# Altium schematic sheet 2012_FDP_SCHEMA.SchDoc
size A1
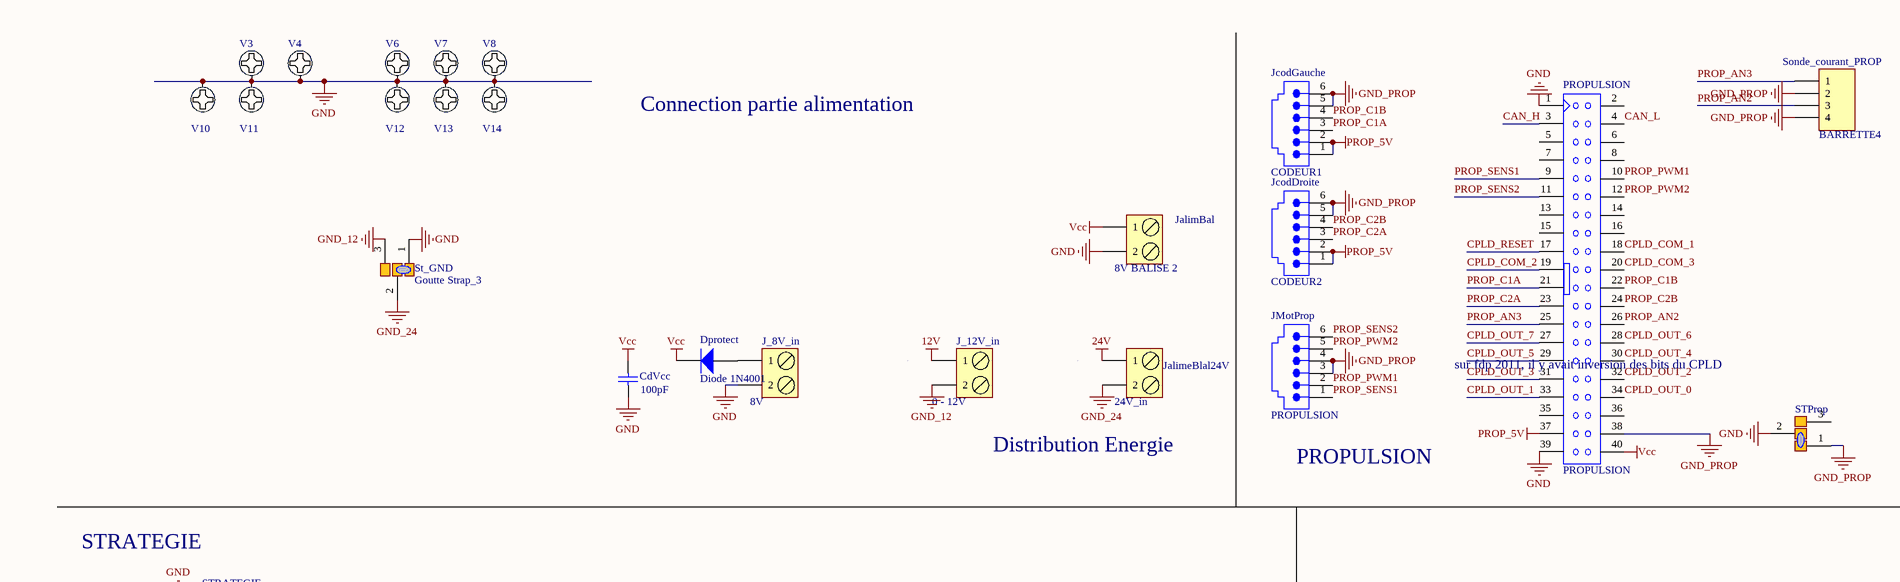
[diagram p0: 2012_FDP_SCHEMA.SchDoc, top left]
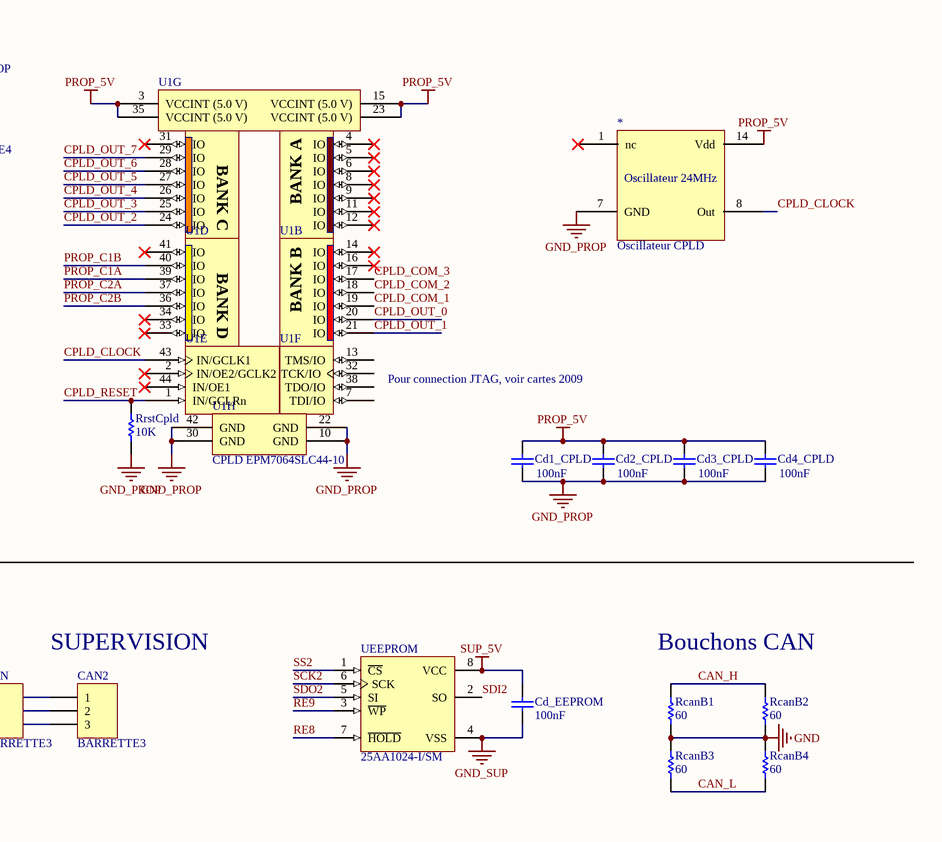
[diagram p1: 2012_FDP_SCHEMA.SchDoc, top right]
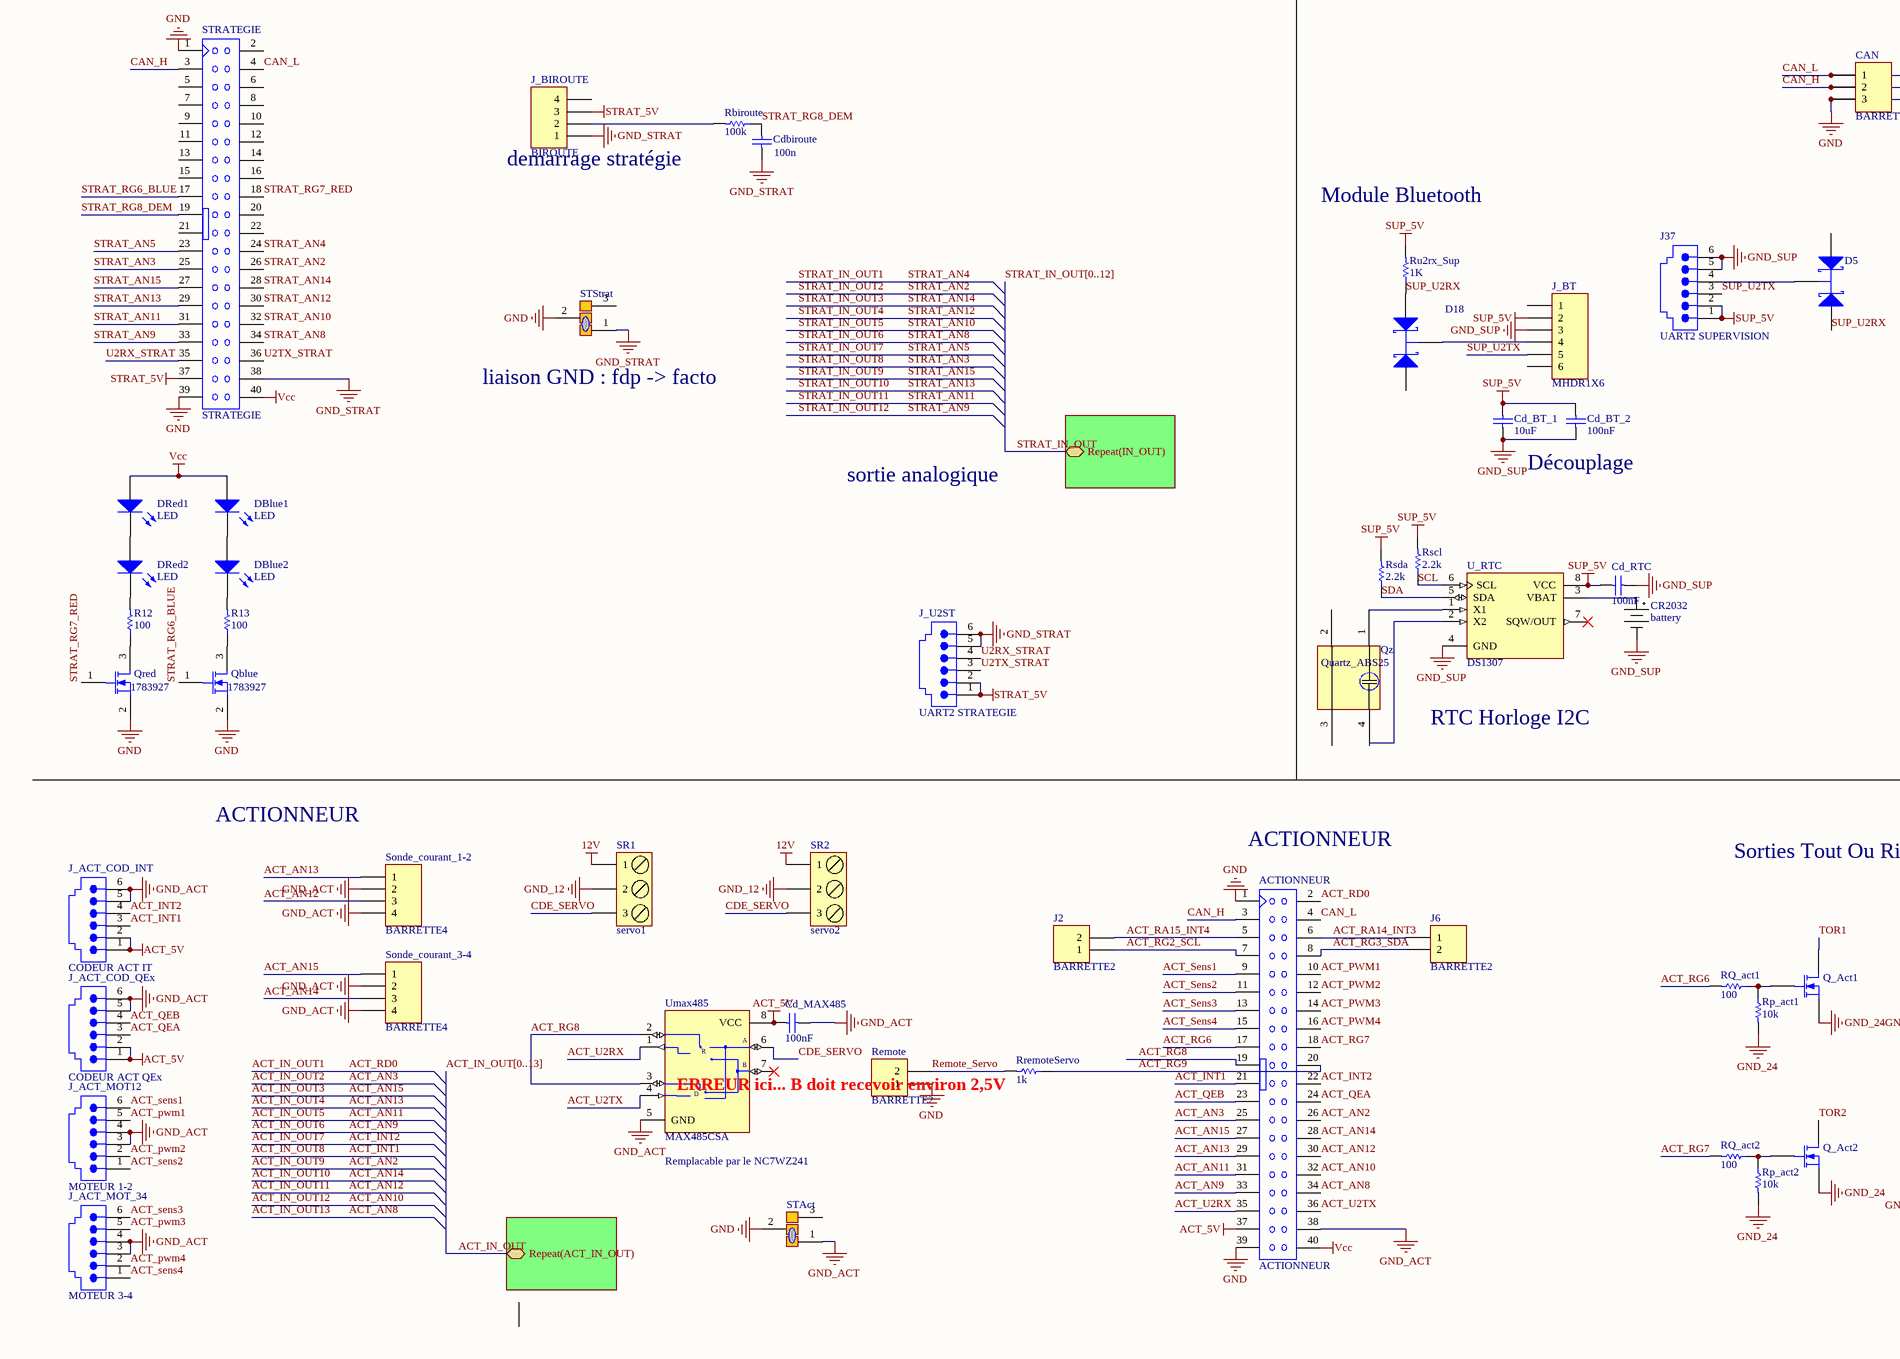
[diagram p2: 2012_FDP_SCHEMA.SchDoc, bottom left]
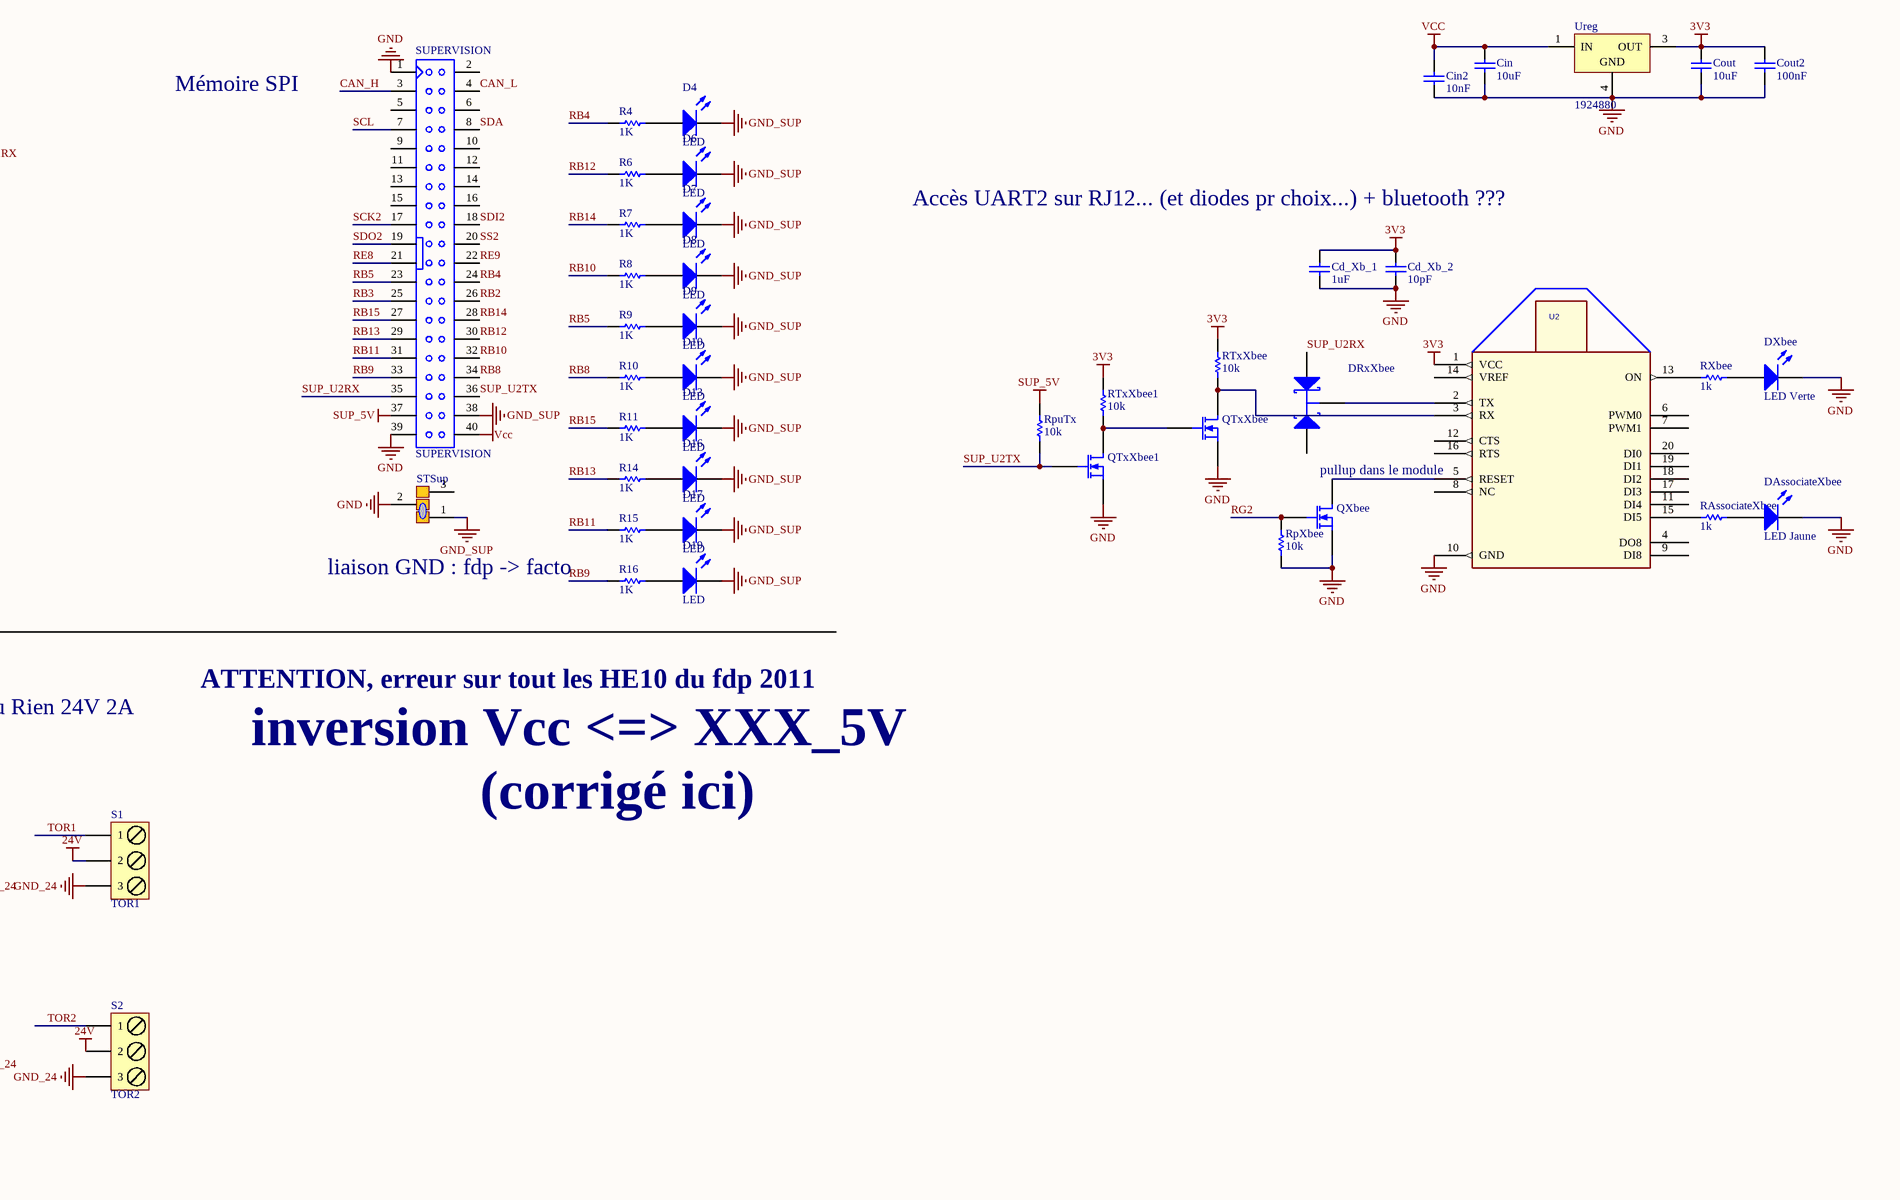
[diagram p3: 2012_FDP_SCHEMA.SchDoc, bottom right]

## Parts
*  Oscillateur CPLD  [DIL14_OSCILLATEUR]
ACTIONNEUR  ACTIONNEUR  [HE10/40_MAL_DROIT-FDP-ROBOT]
CAN  BARRETTE3  [HE14_3]
CAN2  BARRETTE3  [HE14_3]
Cd1_CPLD  value 100nF  [C0805_N]  (hidden comment: Condensateur)
Cd2_CPLD  value 100nF  [C0805_N]  (hidden comment: Condensateur)
Cd3_CPLD  value 100nF  [C0805_N]  (hidden comment: Condensateur)
Cd4_CPLD  value 100nF  [C0805_N]  (hidden comment: Condensateur)
Cd_BT_1  10uF  [C0805_N]
Cd_BT_2  100nF  [C0805_N]
Cd_EEPROM  100nF  [C0805_N]
Cd_MAX485  100nF  [C0805_N]
Cd_RTC  100nF  [C0805_N]
Cd_Xb_1  1uF  [C0805_N]
Cd_Xb_2  10pF  [C0805_N]
Cdbiroute  value 100n  [C0805_N]  (hidden comment: Condensateur)
CdVcc  value 100pF  [C0805_N]  (hidden comment: Condensateur)
Cin  10uF  [C1206_N]
Cin2  10nF  [C0805_N]
Cout  10uF  [C1206_N]
Cout2  100nF  [C0805_N]
CR2032  battery  [Pile_boutton]
D4  LED  [LED_0805]
D5  Diode Shottky double BAT54C  [SOT23-3N]  (value not drawn)
D6  LED  [LED_0805]
D7  LED  [LED_0805]
D8  LED  [LED_0805]
D9  LED  [LED_0805]
D10  LED  [LED_0805]
D13  LED  [LED_0805]
D16  LED  [LED_0805]
D17  LED  [LED_0805]
D18  Diode Shottky double BAT54C  [SOT23-3N]  (value not drawn)
D19  LED  [LED_0805]
DAssociateXbee  LED Jaune  [LED_0805]
DBlue1  LED  [LED_5mm]
DBlue2  LED  [LED_5mm]
Dprotect  Diode 1N4001  [DIO10.46-5.3x2.8]
DRed1  LED  [LED_5mm]
DRed2  LED  [LED_5mm]
DRxXbee  Diode Shottky double BAT54C  [SOT23-3N]  (value not drawn)
DXbee  LED Verte  [LED_0805]
J2  BARRETTE2  [HDR1X2]
J6  BARRETTE2  [HDR1X2]
J37  UART2 SUPERVISION  [RJ11_6/6]
J_8V_in  8V  [BORNIER2]
J_12V_in  0 - 12V  [BORNIER2_FEM_COUDE]
J_ACT_COD_INT  CODEUR ACT IT  [RJ11_6/6 - droit]
J_ACT_COD_QEx  CODEUR ACT QEx  [RJ11_6/6 - droit]
J_ACT_MOT12  MOTEUR 1-2  [RJ11_6/6 - droit]
J_ACT_MOT_34  MOTEUR 3-4  [RJ11_6/6 - droit]
J_BIROUTE  BIROUTE  [HE14_4]
J_BT  MHDR1X6  [HE14_6]
J_U2ST  UART2 STRATEGIE  [RJ11_6/6 - droit]
JalimBal  8V BALISE 2  [BORNIER2]
JalimeBlal24V  24V_in  [BORNIER2_FEM_COUDE]
JcodDroite  CODEUR2  [RJ11_6/6 - droit]
JcodGauche  CODEUR1  [RJ11_6/6 - droit]
JMotProp  PROPULSION  [RJ11_6/6 - droit]
PROPULSION  PROPULSION  [HE10/40_MAL_DROIT-FDP-ROBOT]
Q_Act1  Transistor MOSFET-N  [SOT23-3N]  (value not drawn)
Q_Act2  Transistor MOSFET-N  [SOT23-3N]  (value not drawn)
Qblue  FAR: 1783927  [SOT23-3N]  (hidden comment: Transistor MOSFET-N)
Qred  FAR: 1783927  [SOT23-3N]  (hidden comment: Transistor MOSFET-N)
QTxXbee  Transistor MOSFET-N  [SOT23-3N]  (value not drawn)
QTxXbee1  Transistor MOSFET-N  [SOT23-3N]  (value not drawn)
QXbee  Transistor MOSFET-N  [SOT23-3N]  (value not drawn)
Qz  Quartz_ABS25  [Quartz_ABS25]
R4  1K  [R1206_N]
R6  1K  [R1206_N]
R7  1K  [R1206_N]
R8  1K  [R1206_N]
R9  1K  [R1206_N]
R10  1K  [R1206_N]
R11  1K  [R1206_N]
R12  100  [R1206_N]
R13  100  [R1206_N]
R14  1K  [R1206_N]
R15  1K  [R1206_N]
R16  1K  [R1206_N]
RAssociateXbee  1k  [R1206_N]
Rbiroute  100k  [R1206_N]
RcanB1  60  [R1206_N]
RcanB2  60  [R1206_N]
RcanB3  60  [R1206_N]
RcanB4  60  [R1206_N]
Remote  BARRETTE2  [HDR1X2]
Rp_act1  10k  [R1206_N]
Rp_act2  10k  [R1206_N]
RpuTx  10k  [R1206_N]
RpXbee  10k  [R1206_N]
RQ_act1  100  [R1206_N]
RQ_act2  100  [R1206_N]
RremoteServo  1k  [R1206_N]
RrstCpld  10K  [R1206_N]
Rscl  2.2k  [R1206_N]
Rsda  2.2k  [R1206_N]
RTxXbee  10k  [R1206_N]
RTxXbee1  10k  [R1206_N]
Ru2rx_Sup  1K  [R1206_N]
RXbee  1k  [R1206_N]
S1  TOR1  [BORNIER3_FEM_COUDE]
S2  TOR2  [BORNIER3_FEM_COUDE]
Sonde_courant_1-2  BARRETTE4  [HE14_4]
Sonde_courant_3-4  BARRETTE4  [HE14_4]
Sonde_courant_PROP  BARRETTE4  [HE14_4]
SR1  servo1  [BORNIER3_FEM_COUDE]
SR2  servo2  [BORNIER3_FEM_COUDE]
St_GND  Goutte Strap_3  [Goutte Strap_3]
STAct  Goutte Strap_3  [Goutte Strap_3]  (value not drawn)
STProp  Goutte Strap_3  [Goutte Strap_3]  (value not drawn)
STRATEGIE  STRATEGIE  [HE10/40_MAL_DROIT-FDP-ROBOT]
STStrat  Goutte Strap_3  [Goutte Strap_3]  (value not drawn)
STSup  Goutte Strap_3  [Goutte Strap_3]  (value not drawn)
SUPERVISION  SUPERVISION  [HE10/40_MAL_DROIT-FDP-ROBOT]
U1  CPLD EPM7064SLC44-10  [PLCC44_SUPPORT]  (value not drawn)  (parts A,B,C,D,E,F,G,H of 8)
U2  XBee  [MODULE_XBEE]  (value not drawn)
U_RTC  DS1307  [SO8_N]
UEEPROM  25AA1024-I/SM  [SOIJ-SM8_N]
Umax485  MAX485CSA  [NSO8_N]
Ureg  1924880  [369A-13]
V3  Pad_M3  [M3x6mm]  (value not drawn)
V4  Pad_M3  [M3x6mm]  (value not drawn)
V6  Pad_M3  [M3x6mm]  (value not drawn)
V7  Pad_M3  [M3x6mm]  (value not drawn)
V8  Pad_M3  [M3x6mm]  (value not drawn)
V10  Pad_M3  [M3x6mm]  (value not drawn)
V11  Pad_M3  [M3x6mm]  (value not drawn)
V12  Pad_M3  [M3x6mm]  (value not drawn)
V13  Pad_M3  [M3x6mm]  (value not drawn)
V14  Pad_M3  [M3x6mm]  (value not drawn)

## Sub-sheets
Repeat(PortAct,1,13) = 2012_FDP_Generic_Port_Act.SchDoc: Repeat(ACT_IN_OUT)
Repeat(PortStrat,1,12) = 2012_FDP_Generic_Port_Strat.SchDoc: Repeat(IN_OUT)

## Nets
3V3: Cd_Xb_1.2 Cd_Xb_2.2 Cout.2 Cout2.2 RTxXbee.1 RTxXbee1.1 U2.1(VCC) Ureg.3(OUT)
12V: J_12V_in.1 SR1.1 SR2.1
24V: JalimeBlal24V.1 S1.2 S2.2
ACT_5V: ACTIONNEUR.37 Cd_MAX485.2 J_ACT_COD_INT.1 J_ACT_COD_INT.2 J_ACT_COD_QEx.1 J_ACT_COD_QEx.2 Umax485.8(VCC)
GND: ACTIONNEUR.1 ACTIONNEUR.39 CAN.3 CAN2.3 Cd_Xb_1.1 Cd_Xb_2.1 CdVcc.1 Cin.1 Cin2.1 Cout.1 Cout2.1 DAssociateXbee.2(K) DXbee.2(K) J_8V_in.2 JalimBal.2 PROPULSION.1 PROPULSION.39 Qblue.2(S) Qred.2(S) QTxXbee.3(S) QTxXbee1.3(S) QXbee.3(S) RcanB1.1 RcanB2.1 RcanB3.2 RcanB4.2 Remote.1 RpXbee.2 St_GND.1 STAct.2 STProp.2 STRATEGIE.1 STRATEGIE.39 STStrat.2 STSup.2 SUPERVISION.1 SUPERVISION.39 U2.10(GND) Ureg.4(GND) V3.1 V4.1 V6.1 V7.1 V8.1 V10.1 V11.1 V12.1 V13.1 V14.1
GND_12: J_12V_in.2 SR1.2 SR2.2 St_GND.3
GND_24: JalimeBlal24V.2 Q_Act1.3(S) Q_Act2.3(S) Rp_act1.2 Rp_act2.2 S1.3 S2.3 St_GND.2
GND_ACT: ACTIONNEUR.38 Cd_MAX485.1 J_ACT_COD_INT.5 J_ACT_COD_INT.6 J_ACT_COD_QEx.5 J_ACT_COD_QEx.6 J_ACT_MOT12.3 J_ACT_MOT12.4 J_ACT_MOT_34.3 J_ACT_MOT_34.4 Sonde_courant_1-2.2 Sonde_courant_1-2.4 Sonde_courant_3-4.2 Sonde_courant_3-4.4 STAct.1 Umax485.5(GND)
GND_PROP: *.7(GND) Cd1_CPLD.1 Cd2_CPLD.1 Cd3_CPLD.1 Cd4_CPLD.1 JcodDroite.5 JcodDroite.6 JcodGauche.5 JcodGauche.6 JMotProp.3 JMotProp.4 PROPULSION.38 RrstCpld.1 Sonde_courant_PROP.2 Sonde_courant_PROP.4 STProp.1 U1.10(GND) U1.22(GND) U1.30(GND) U1.42(GND)
GND_STRAT: Cdbiroute.1 J_BIROUTE.1 J_U2ST.5 J_U2ST.6 STRATEGIE.38 STStrat.1
GND_SUP: Cd_BT_1.1 Cd_BT_2.1 Cd_EEPROM.1 Cd_RTC.1 CR2032.2(-) D4.2(K) D6.2(K) D7.2(K) D8.2(K) D9.2(K) D10.2(K) D13.2(K) D16.2(K) D17.2(K) D19.2(K) J37.5 J37.6 J_BT.3 STSup.1 SUPERVISION.38 U_RTC.4(GND) UEEPROM.4(VSS)
PROP_5V: *.14(Vdd) Cd1_CPLD.2 Cd2_CPLD.2 Cd3_CPLD.2 Cd4_CPLD.2 JcodDroite.1 JcodDroite.2 JcodGauche.1 JcodGauche.2 PROPULSION.37 U1.3(VCCINT_(5.0_V)) U1.15(VCCINT_(5.0_V)) U1.23(VCCINT_(5.0_V)) U1.35(VCCINT_(5.0_V))
STRAT_5V: J_BIROUTE.3 J_U2ST.1 J_U2ST.2 STRATEGIE.37
SUP_5V: Cd_BT_1.2 Cd_BT_2.2 Cd_EEPROM.2 Cd_RTC.2 J37.1 J37.2 J_BT.2 RpuTx.1 Rscl.2 Rsda.2 Ru2rx_Sup.2 SUPERVISION.37 U_RTC.8(VCC) UEEPROM.8(VCC)
Vcc: ACTIONNEUR.40 CdVcc.2 Cin.2 Cin2.2 DBlue1.1(A) Dprotect.2(K) DRed1.1(A) JalimBal.1 PROPULSION.40 STRATEGIE.40 SUPERVISION.40 Ureg.1(IN)
ACT_AN2: ACTIONNEUR.26  [also labelled ACT_IN_OUT9]
ACT_AN3: ACTIONNEUR.25  [also labelled ACT_IN_OUT2]
ACT_AN8: ACTIONNEUR.34  [also labelled ACT_IN_OUT13]
ACT_AN9: ACTIONNEUR.33  [also labelled ACT_IN_OUT6]
ACT_AN10: ACTIONNEUR.32  [also labelled ACT_IN_OUT12]
ACT_AN11: ACTIONNEUR.31  [also labelled ACT_IN_OUT5]
ACT_AN12: ACTIONNEUR.30 Sonde_courant_1-2.3  [also labelled ACT_IN_OUT11]
ACT_AN13: ACTIONNEUR.29 Sonde_courant_1-2.1  [also labelled ACT_IN_OUT4]
ACT_AN14: ACTIONNEUR.28 Sonde_courant_3-4.3  [also labelled ACT_IN_OUT10]
ACT_AN15: ACTIONNEUR.27 Sonde_courant_3-4.1  [also labelled ACT_IN_OUT3]
ACT_IN_OUT: sheet Repeat(PortAct,1,13)/Repeat(ACT_IN_OUT)
ACT_IN_OUT1: ACTIONNEUR.2  [also labelled ACT_RD0]
ACT_IN_OUT7: ACTIONNEUR.22 J_ACT_COD_INT.4  [also labelled ACT_INT2]
ACT_IN_OUT8: ACTIONNEUR.21 J_ACT_COD_INT.3  [also labelled ACT_INT1]
ACT_pwm1: ACTIONNEUR.10 J_ACT_MOT12.5
ACT_pwm2: ACTIONNEUR.12 J_ACT_MOT12.2
ACT_pwm3: ACTIONNEUR.14 J_ACT_MOT_34.5
ACT_pwm4: ACTIONNEUR.16 J_ACT_MOT_34.2
ACT_QEA: ACTIONNEUR.24 J_ACT_COD_QEx.3
ACT_QEB: ACTIONNEUR.23 J_ACT_COD_QEx.4
ACT_RA14_INT3: ACTIONNEUR.6 J6.1
ACT_RA15_INT4: ACTIONNEUR.5 J2.2
ACT_RG2_SCL: ACTIONNEUR.7 J2.1
ACT_RG3_SDA: ACTIONNEUR.8 J6.2
ACT_RG6: ACTIONNEUR.17 RQ_act1.2
ACT_RG7: ACTIONNEUR.18 RQ_act2.2
ACT_RG8: ACTIONNEUR.19 Umax485.2(~{RE}) Umax485.3(DE)
ACT_RG9: ACTIONNEUR.20 RremoteServo.1
ACT_sens1: ACTIONNEUR.9 J_ACT_MOT12.6
ACT_sens2: ACTIONNEUR.11 J_ACT_MOT12.1
ACT_sens3: ACTIONNEUR.13 J_ACT_MOT_34.6
ACT_sens4: ACTIONNEUR.15 J_ACT_MOT_34.1
ACT_U2RX: ACTIONNEUR.35 Umax485.1(RO)
ACT_U2TX: ACTIONNEUR.36 Umax485.4(DI)
CAN_H: ACTIONNEUR.3 CAN.2 CAN2.2 PROPULSION.3 RcanB1.2 RcanB2.2 STRATEGIE.3 SUPERVISION.3
CAN_L: ACTIONNEUR.4 CAN.1 CAN2.1 PROPULSION.4 RcanB3.1 RcanB4.1 STRATEGIE.4 SUPERVISION.4
CDE_SERVO: SR1.3 SR2.3 Umax485.6(A)
CPLD_CLOCK: *.8(Out) U1.43(IN/GCLK1)
CPLD_COM_1: PROPULSION.18 U1.19(IO)
CPLD_COM_2: PROPULSION.19 U1.18(IO)
CPLD_COM_3: PROPULSION.20 U1.17(IO)
CPLD_OUT_0: PROPULSION.34 U1.20(IO)
CPLD_OUT_1: PROPULSION.33 U1.21(IO)
CPLD_OUT_2: PROPULSION.32 U1.24(IO)
CPLD_OUT_3: PROPULSION.31 U1.25(IO)
CPLD_OUT_4: PROPULSION.30 U1.26(IO)
CPLD_OUT_5: PROPULSION.29 U1.27(IO)
CPLD_OUT_6: PROPULSION.28 U1.28(IO)
CPLD_OUT_7: PROPULSION.27 U1.29(IO)
CPLD_RESET: PROPULSION.17 RrstCpld.2 U1.1(IN/GCLRn)
PROP_AN2: PROPULSION.26 Sonde_courant_PROP.3
PROP_AN3: PROPULSION.25 Sonde_courant_PROP.1
PROP_C1A: JcodGauche.3 PROPULSION.21 U1.39(IO)
PROP_C1B: JcodGauche.4 PROPULSION.22 U1.40(IO)
PROP_C2A: JcodDroite.3 PROPULSION.23 U1.37(IO)
PROP_C2B: JcodDroite.4 PROPULSION.24 U1.36(IO)
PROP_PWM1: JMotProp.2 PROPULSION.10
PROP_PWM2: JMotProp.5 PROPULSION.12
PROP_SENS1: JMotProp.1 PROPULSION.9
PROP_SENS2: JMotProp.6 PROPULSION.11
RB2: SUPERVISION.26
RB3: SUPERVISION.25
RB4: R4.1 SUPERVISION.24
RB5: R9.1 SUPERVISION.23
RB8: R10.1 SUPERVISION.34
RB9: R16.1 SUPERVISION.33
RB10: R8.1 SUPERVISION.32
RB11: R15.1 SUPERVISION.31
RB12: R6.1 SUPERVISION.30
RB13: R14.1 SUPERVISION.29
RB14: R7.1 SUPERVISION.28
RB15: R11.1 SUPERVISION.27
RE8: SUPERVISION.21 UEEPROM.7(~{HOLD})
RE9: SUPERVISION.22 UEEPROM.3(~{WP})
Remote_Servo: Remote.2 RremoteServo.2
RG2: QXbee.2(G) RpXbee.1
SCK2: SUPERVISION.17 UEEPROM.6(SCK)
SCL: Rscl.1 SUPERVISION.7 U_RTC.6(SCL)
SDA: Rsda.1 SUPERVISION.8 U_RTC.5(SDA)
SDI2: SUPERVISION.18 UEEPROM.2(SO)
SDO2: SUPERVISION.19 UEEPROM.5(SI)
SS2: SUPERVISION.20 UEEPROM.1(~{CS})
STRAT_AN2: STRATEGIE.26  [also labelled STRAT_IN_OUT2]
STRAT_AN3: STRATEGIE.25  [also labelled STRAT_IN_OUT8]
STRAT_AN4: STRATEGIE.24  [also labelled STRAT_IN_OUT1]
STRAT_AN5: STRATEGIE.23  [also labelled STRAT_IN_OUT7]
STRAT_AN8: STRATEGIE.34  [also labelled STRAT_IN_OUT6]
STRAT_AN9: STRATEGIE.33  [also labelled STRAT_IN_OUT12]
STRAT_AN10: STRATEGIE.32  [also labelled STRAT_IN_OUT5]
STRAT_AN11: STRATEGIE.31  [also labelled STRAT_IN_OUT11]
STRAT_AN12: STRATEGIE.30  [also labelled STRAT_IN_OUT4]
STRAT_AN13: STRATEGIE.29  [also labelled STRAT_IN_OUT10]
STRAT_AN14: STRATEGIE.28  [also labelled STRAT_IN_OUT3]
STRAT_AN15: STRATEGIE.27  [also labelled STRAT_IN_OUT9]
STRAT_IN_OUT: sheet Repeat(PortStrat,1,12)/Repeat(IN_OUT)
STRAT_RG6_BLUE: Qblue.1(G) STRATEGIE.17
STRAT_RG7_RED: Qred.1(G) STRATEGIE.18
STRAT_RG8_DEM: Cdbiroute.2 Rbiroute.1 STRATEGIE.19
SUP_U2RX: D5.1(A1) D18.1(A1) DRxXbee.1(A1) Ru2rx_Sup.1 SUPERVISION.35
SUP_U2TX: J37.3 J_BT.5 QTxXbee1.2(G) RpuTx.2 SUPERVISION.36
TOR1: Q_Act1.1(D) S1.1
TOR2: Q_Act2.1(D) S2.1
U2RX_STRAT: J_U2ST.4 STRATEGIE.35
U2TX_STRAT: J_U2ST.3 STRATEGIE.36
NetCR2032_1: CR2032.1(+) U_RTC.3(VBAT)
NetD4_1: D4.1(A) R4.2
NetD5_3: D5.3(K) J37.4
NetD6_1: D6.1(A) R6.2
NetD7_1: D7.1(A) R7.2
NetD8_1: D8.1(A) R8.2
NetD9_1: D9.1(A) R9.2
NetD10_1: D10.1(A) R10.2
NetD13_1: D13.1(A) R11.2
NetD16_1: D16.1(A) R14.2
NetD17_1: D17.1(A) R15.2
NetD18_3: D18.3(K) J_BT.4
NetD19_1: D19.1(A) R16.2
NetDAssociateXbee_1: DAssociateXbee.1(A) RAssociateXbee.2
NetDBlue1_2: DBlue1.2(K) DBlue2.1(A)
NetDBlue2_2: DBlue2.2(K) R13.2
NetDprotect_1: Dprotect.1(A) J_8V_in.1
NetDRed1_2: DRed1.2(K) DRed2.1(A)
NetDRed2_2: DRed2.2(K) R12.2
NetDRxXbee_3: DRxXbee.3(K) U2.2(TX)
NetDXbee_1: DXbee.1(A) RXbee.2
NetJ_BIROUTE_2: J_BIROUTE.2 Rbiroute.2
NetQ_Act1_2: Q_Act1.2(G) Rp_act1.1 RQ_act1.1
NetQ_Act2_2: Q_Act2.2(G) Rp_act2.1 RQ_act2.1
NetQblue_3: Qblue.3(D) R13.1
NetQred_3: Qred.3(D) R12.1
NetQTxXbee_1: QTxXbee.1(D) RTxXbee.2 U2.3(RX)
NetQTxXbee_2: QTxXbee.2(G) QTxXbee1.1(D) RTxXbee1.2
NetQXbee_1: QXbee.1(D) U2.5(RESET)
NetQz_1: Qz.1 U_RTC.1(X1)
NetQz_4: Qz.4 U_RTC.2(X2)
NetRAssociateXbee_1: RAssociateXbee.1 U2.15(DI5)
NetRXbee_1: RXbee.1 U2.13(ON)

Not connected (* = marked no-connect by the designer): * 1(nc)*; D5 2(A2); D18 2(A2); DRxXbee 2(A2); J_BIROUTE 4; J_BT 1 6; PROPULSION 2 5 6 7 8 13 14 15 16 35 36; Qz 2 3; STAct 3; STProp 3; STRATEGIE 2 5 6 7 8 9 10 11 12 13 14 15 16 20 21 22; STStrat 3; STSup 3; SUPERVISION 2 5 6 9 10 11 12 13 14 15 16; U1 2(IN/OE2/GCLK2)* 4(IO)* 5(IO)* 6(IO)* 7(TDI/IO) 8(IO)* 9(IO)* 11(IO)* 12(IO)* 13(TMS/IO) 14(IO)* 16(IO)* 31(IO)* 32(TCK/IO) 33(IO)* 34(IO)* 38(TDO/IO) 41(IO)* 44(IN/OE1)*; U2 4(DO8) 6(PWM0) 7(PWM1) 8(NC) 9(DI8) 11(DI4) 12(CTS) 14(VREF) 16(RTS) 17(DI3) 18(DI2) 19(DI1) 20(DI0); U_RTC 7(SQW/OUT)*; Umax485 7(B)*

## Buses and harness runs
bus ACT_IN_OUT[0..13]
bus STRAT_IN_OUT[0..12]

## Notes on the sheet
- Connection partie alimentation
- Pour connection JTAG, voir cartes 2009
- (near PROPULSION) sur fdp 2011, il y avait inversion des bits du CPLD
- Distribution Energie
- PROPULSION
- STRATEGIE
- (near CAN2) SUPERVISION
- Bouchons CAN
- (near J_BIROUTE) demarrage stratégie
- Module Bluetooth
- Mémoire SPI
- (near STStrat) liaison GND : fdp -> facto
- Accès UART2 sur RJ12... (et diodes pr choix...) + bluetooth ???
- sortie analogique
- Découplage
- (near U2) pullup dans le module
- RTC Horloge I2C
- (near R16) liaison GND : fdp -> facto
- ACTIONNEUR
- Sorties Tout Ou Rien 24V 2A
- ATTENTION, erreur sur tout les HE10 du fdp 2011
- inversion Vcc <=> XXX_5V
- (corrigé ici)
- ERREUR ici... B doit recevoir environ 2,5V
- Remplacable par le NC7WZ241
- (in symbol CPLD EPM7064SLC44-10, part A) BANK A
- (in symbol CPLD EPM7064SLC44-10, part B) BANK B
- (in symbol CPLD EPM7064SLC44-10, part C) BANK C
- (in symbol CPLD EPM7064SLC44-10, part D) BANK D
- (in symbol MAX485CSA) R; D
- (in symbol Oscillateur CPLD) Oscillateur 24MHz

## Library data of the parts
ACTIONNEUR PROPULSION STRATEGIE SUPERVISION = HE10/40: Connector; HE10; 40 Position; Male
CAN CAN2 = BARRETTE3: Header, 3-Pin; LatestRevisionDate: 17-Jul-2002; LatestRevisionNote: Re-released for DXP Platform.; Publisher: Altium Limited
Cd1_CPLD Cd2_CPLD Cd3_CPLD Cd4_CPLD Cd_BT_1 Cd_BT_2 Cd_EEPROM Cd_MAX485 Cd_RTC Cd_Xb_1 Cd_Xb_2 Cdbiroute CdVcc = Condensateur: Capacitor; Published: 8-Jun-2000; LatestRevisionDate: 17-Jul-2002; LatestRevisionNote: Re-released for DXP Platform.; PackageReference: RAD-0.3; Publisher: Altium Limited
Cin Cin2 Cout Cout2 = Capacitor: Published: 8-Jun-2000; LatestRevisionDate: 17-Jul-2002; LatestRevisionNote: Re-released for DXP Platform.; PackageReference: RAD-0.3; Publisher: Altium Limited
CR2032 = battery: Battery, Pile; Tech: CMOS; Type: Alim; Eco Plan: RoHS Compliant; ComponentLink0Description: PIN assignation for the battery component; ComponentLink1Description: Manufacturer Link; ComponentLink2Description: Handbook; ComponentLink3Description: Packaging Specification; Created: 08-08-07; LatestRevisionDate: 08-08-07; LatestRevisionNote: creation; PackageDescription: 2-pins; PackageVersion: ver1.0, Aug-2007; Published: 03-07-07; Publisher: Jean-Philippe Oudet
D4 D6-D10 D13 D16 D17 D19 DAssociateXbee DBlue1 DBlue2 DRed1 DRed2 DXbee = LED: Typical LED; Published: 8-Jun-2000; LatestRevisionDate: 08-Jul-2005; LatestRevisionNote: Mech Layer 1 removed.; PackageReference: LED-1; Publisher: Altium Limited
D5 D18 DRxXbee = Diode Shottky double BAT54C: DIODE SCHOTTKY DOUBLE; Manufacturer: ZETEX; Diode Case Style: SOT-23; Description: ZETEX - BAT54C - DIODE SCHOTTKY DOUBLE; Supplier Part Number: 9526501; Supplier: Farnell; ComponentLink1URL: http://www.farnell.com/datasheets/27632.pdf; ComponentLink1Description: http://www.farnell.com/datasheets/27632.pdf; Pricing: 5=0,32, 25=0,23, 100=0,198, 1000=0,154 (EUR); RoHS: YES; Manufacturer Part Number: BAT54C
Dprotect = Diode 1N4001: 1 Amp General Purpose Rectifier; Published: 8-Jun-2000; LatestRevisionDate: 17-Jul-2002; LatestRevisionNote: Re-released for DXP Platform.; DatasheetVersion: 1998; PackageVersion: Aug-1999; PackageReference: DO-41; Publisher: Altium Limited; Code_JEDEC: DO-204-AL; ComponentLink1Description: Manufacturer Link; ComponentLink1URL: http://www.fairchildsemi.com/; ComponentLink2Description: Datasheet; ComponentLink2URL: http://www.fairchildsemi.com/ds/1N%2F1N4001.pdf
J2 J6 Remote = BARRETTE2: Header, 2-Pin; LatestRevisionDate: 17-Jul-2002; LatestRevisionNote: Re-released for DXP Platform.; Publisher: Altium Limited
J37 J_ACT_COD_INT J_ACT_COD_QEx J_ACT_MOT12 J_ACT_MOT_34 J_U2ST JcodDroite JcodGauche JMotProp = RJ11_6/6: Right Angle, Standard Profile, Offset Latch DECconnect, Flangeless PCB Jack; Ports: 1; Positions/Loaded: Port1 - 6 Offset Latch/6; PerformanceCategory: 3; PCB_Mounting: Thru-Hole; DrillSize: Nominal, Rounded to nearest 0.05mm; PCB_Layout: Complies with Manufacturer's Recommendation.; Published: 25-Jun-2002; DatasheetDocument: 18-Dec-2001; PackageDocument: 18-Dec-2001; PackageReference: 15-43-6110; Publisher: Altium Limited; ComponentLink1Description: Manufacturer Link; ComponentLink1URL: http://www.molex.com/; ComponentLink2Description: Datasheet; ComponentLink2URL: http://www.molex.com/cmc_upload/common_files/1212003_41369catalogpage.pdf
J_8V_in J_12V_in JalimBal JalimeBlal24V = BORNIER2: Terminal blocks, 2 pins, pitch=5mm
J_BIROUTE Sonde_courant_1-2 Sonde_courant_3-4 Sonde_courant_PROP = BARRETTE4: Header, 4-Pin; LatestRevisionDate: 17-Jul-2002; LatestRevisionNote: Re-released for DXP Platform.; Publisher: Altium Limited
J_BT = MHDR1X6: Header, 6-Pin; LatestRevisionDate: 17-Jul-2002; LatestRevisionNote: Re-released for DXP Platform.; Publisher: Altium Limited
Q_Act1 Q_Act2 Qblue Qred QTxXbee QTxXbee1 QXbee = Transistor MOSFET-N: N-Channel MOSFET; PackageDocument: 1995/1996; Published: 8-Jun-2000; LatestRevisionDate: 17-Jul-2002; LatestRevisionNote: Re-released for DXP Platform.; PackageReference: E3; Publisher: Altium Limited
R4 R6-R16 RAssociateXbee Rbiroute RcanB1-RcanB4 Rp_act1 Rp_act2 RpuTx RpXbee RQ_act1 RQ_act2 RremoteServo RrstCpld Rscl Rsda RTxXbee RTxXbee1 Ru2rx_Sup RXbee = Resistor: Published: 8-Jun-2000; LatestRevisionDate: 17-Jul-2002; LatestRevisionNote: Re-released for DXP Platform.; PackageReference: AXIAL-0.5; Publisher: Altium Limited
S1 S2 SR1 SR2 = BORNIER3: Terminal blocks, 2 pins, pitch=5mm
U1 = CPLD EPM7064SLC44-10: MAX 7000S 5V In-System Programmable CPLD, 64 Macrocells, 44-Pin PLCC, Speed Grade 10, Commercial Grade; Published: 24-Nov-2000; LatestRevisionDate: 13-Apr-2006; LatestRevisionNote: IPC-7351 Footprint Added.; DatasheetVersion: ver6.7, Sep-2005; PackageVersion: ver14.3, Jul-2006; PackageReference: PLCC44; Publisher: Altium Limited; PackageDescription: 44-Pin Plastic J-Lead Chip Carrier (PLCC44); Code_JEDEC: MS-018-AC; Code_IPC: PLCC-44; ComponentLink1Description: Manufacturer Link; ComponentLink1URL: http://www.altera.com/products/devices/max7k/m7k-index.html; ComponentLink2Description: Datasheet; ComponentLink2URL: http://www.altera.com/literature/ds/m7000.pdf; ComponentLink3Description: Packaging Specification; ComponentLink3URL: http://www.altera.com/literature/ds/dspkg.pdf
U_RTC = DS1307: 64 X 8 Serial Real-Time Clock; Published: 13-Oct-2000; LatestRevisionDate: 06-Jun-2005; LatestRevisionNote: Stylized 3D Model Added.; DatasheetVersion: 10-Aug-1999; PackageVersion: 1999; PackageReference: DIP8; Publisher: Altium Limited; PackageDescription: DIP; 8 Leads; Row Spacing 7.62 mm; Pitch 2.54 mm; ComponentLink1Description: Manufacturer Link; ComponentLink1URL: http://www.maxim-ic.com/; ComponentLink2Description: Datasheet; ComponentLink2URL: http://pdfserv.maxim-ic.com/en/ds/DS1307.pdf; ComponentLink3Description: Discontinuation Notice; ComponentLink3URL: http://www.maxim-ic.com/qa/pdfs/non-obsolescence-letter.pdf
UEEPROM = 25AA1024-I/SM: 1 Mbit SPI Bus Serial EEPROM, 8-Pin SOIC, Industrial Temperature; FirstPublished: 29-Jan-2009; DatasheetVersion: revF, May-2008; PackageVersion: revBB, Aug-2009; PackageReference: SOIJ-SM8; Publisher: Altium Limited; PackageDescription: 8-Lead Plastic Small Outline (SM) - Medium, 5.28 mm Body [SOIJ]; Supplier 1: Digi-Key; Supplier Part Number 1: 25AA1024-I/SM-ND; Supplier 2: Farnell; Supplier Part Number 2: 1555678; Supplier 3: Newark; Supplier Part Number 3: 89H3146; ComponentLink1Description: Datasheet; ComponentLink1URL: http://ww1.microchip.com/downloads/en/DeviceDoc/21836F.pdf; ComponentLink2Description: Packaging Specification; ComponentLink2URL: http://www.microchip.com/stellent/groups/techpub_sg/documents/packagingspec/en012702.pdf; ComponentLink3Description: Microchip.com Home; ComponentLink3URL: http://www.microchip.com/
Umax485 = MAX485CSA: Low-Power, Slew-Rate-Limited RS-485/RS-422 Transceiver; FAR: 9725954; Published: 16-Jan-2001; LatestRevisionDate: 13-Apr-2006; LatestRevisionNote: IPC-7351 Footprint Added.; DatasheetVersion: Feb-1996; PackageReference: NSO8; Publisher: Altium Limited; PackageDescription: 8-Pin Small Outline Integrated Circuit 1.27 mm Pitch; Code_JEDEC: MS-012-AA; Code_IPC: SOIC127P600-8; ComponentLink1Description: Manufacturer Link; ComponentLink1URL: http://www.maxim-ic.com/; ComponentLink2Description: Datasheet; ComponentLink2URL: http://pdfserv.maxim-ic.com/en/ds/MAX1487-MAX491.pdf
Ureg = MC7805ACD2T: Three-Terminal Positive Voltage Regulator; Note: Pin 2 is electrically connected to Pin 4; Pin 2 is trimmed and not drawn;; Published: 15-Apr-2002; DatasheetVersion: 1997; PackageVersion: 1997; PackageReference: 936-03; Publisher: Altium Limited; PackageDescription: D2-PAK/TO-263-AB; 3 Leads (1 Cropped); Body 14.7 (inc. leads) x 10.2 mm (LxW max); ComponentLink1Description: Manufacturer Link; ComponentLink1URL: http://www.onsemi.com/site/products/taxonomy/0,4438,503,00.html; ComponentLink2Description: Datasheet; ComponentLink2URL: http://www.onsemi.com/pub/Collateral/MC7800-D.PDF
V3 V4 V6-V8 V10-V14 = Vis M3 X 6mm _TORX_Tête 6mm: Publisher: Damien Guitton
St_GND STAct STProp STStrat STSup = Goutte Strap_3: LatestRevisionDate: 25/11/09; Publisher: Damien Guitton